# Altium schematic sheet ESP32_PCB.SchDoc
size A4; SheetNumber: 1; SheetTotal: 1
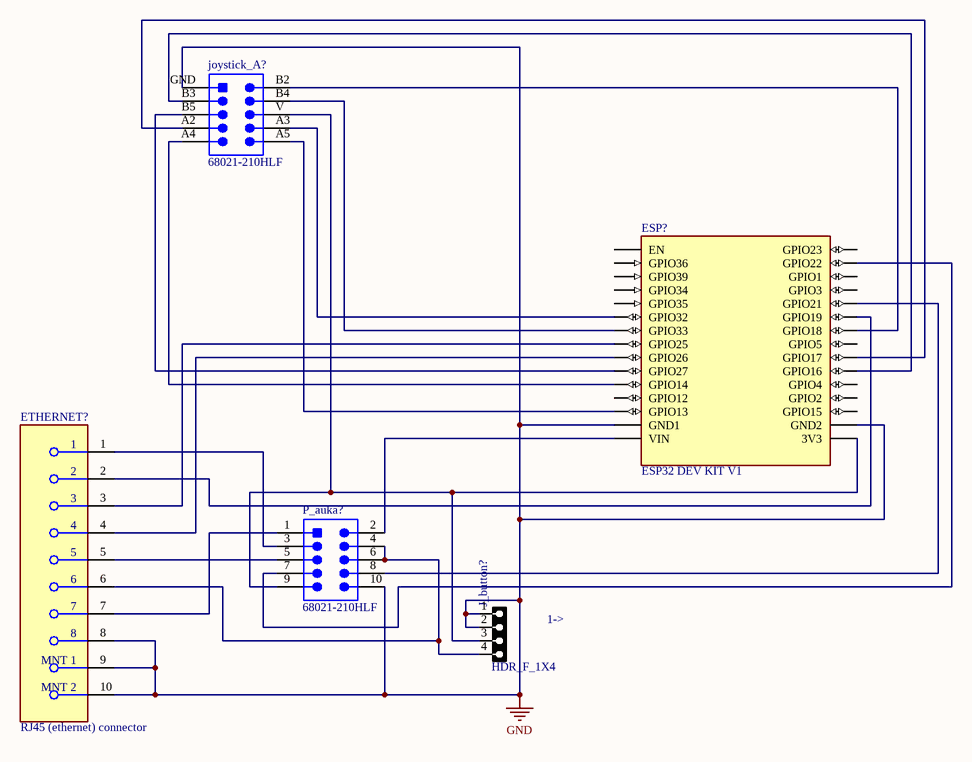
[diagram p0: ESP32_PCB.SchDoc]

## Parts
ESP?  ESP32 DEV KIT V1  [ESP32-DEV-KIT-V1]
ETHERNET?  RJ45 (ethernet) connector  [FP-1-406541-1-MFG]
J_button?  HDR_F_1X4  [HDR_F_1X4]
joystick_A?  68021-210HLF  [FCI-68021-210HLF-10_V]
P_auka?  68021-210HLF  [FCI-68021-210HLF-10_V]

## Nets
GND: ESP?.J1_14(GND1) ESP?.J3_14(GND2) ETHERNET?.8 ETHERNET?.9(MNT_1) ETHERNET?.10(MNT_2) J_button?.1 J_button?.2 joystick_A?.GND P_auka?.10
NetESP?_J1_6: ESP?.J1_6(GPIO32) joystick_A?.A3
NetESP?_J1_7: ESP?.J1_7(GPIO33) joystick_A?.B4
NetESP?_J1_8: ESP?.J1_8(GPIO25) ETHERNET?.3
NetESP?_J1_9: ESP?.J1_9(GPIO26) ETHERNET?.4
NetESP?_J1_10: ESP?.J1_10(GPIO27) joystick_A?.B5
NetESP?_J1_11: ESP?.J1_11(GPIO14) joystick_A?.A4
NetESP?_J1_13: ESP?.J1_13(GPIO13) joystick_A?.A5
NetESP?_J1_15: ESP?.J1_15(VIN) P_auka?.2
NetESP?_J3_2: ESP?.J3_2(GPIO22) P_auka?.7
NetESP?_J3_5: ESP?.J3_5(GPIO21) P_auka?.8
NetESP?_J3_6: ESP?.J3_6(GPIO19) ETHERNET?.2
NetESP?_J3_7: ESP?.J3_7(GPIO18) joystick_A?.B2
NetESP?_J3_9: ESP?.J3_9(GPIO17) joystick_A?.A2
NetESP?_J3_10: ESP?.J3_10(GPIO16) joystick_A?.B3
NetESP?_J3_15: ESP?.J3_15(3V3) J_button?.3 joystick_A?.V P_auka?.9
NetETHERNET?_1: ETHERNET?.1 P_auka?.3
NetETHERNET?_5: ETHERNET?.5 P_auka?.5
NetETHERNET?_6: ETHERNET?.6 J_button?.4 P_auka?.4 P_auka?.6
NetETHERNET?_7: ETHERNET?.7 P_auka?.1

Not connected (* = marked no-connect by the designer): ESP? J1_1(EN) J1_2(GPIO36) J1_3(GPIO39) J1_4(GPIO34) J1_5(GPIO35) J1_12(GPIO12) J3_1(GPIO23) J3_3(GPIO1) J3_4(GPIO3) J3_8(GPIO5) J3_11(GPIO4) J3_12(GPIO2) J3_13(GPIO15)

## Notes on the sheet
- 1->

## Library data of the parts
ESP? = CMP-020-00026-4: ESP-WROOM-32 https://www.aliexpress.com/item/1005006771532302.html; MF: Espressif Systems; Value: *; Pin Count: 30; Design Item ID: ESP32 DEV KIT V1; Source: ESP32-S3-DEVKITC-1-N8R8.SchLib; SnapEDA_Link: https://www.snapeda.com/parts/ESP32-S3-DEVKITC-1-N8R8/Espressif+Systems/view-part/?ref=snap; Package: None; Check_prices: https://www.aliexpress.com/item/1005006771532302.html; MP: ESP-WROOM-32; Component Type: Standard
ETHERNET? = CMP-002-00604-1: Modular Connector, RJ45 Jack, 1 x 1 (Port), 8P8C, Cat5, Through Hole Mount; Gender: Female; Pins: 2; Max Operating Temperature: 85°C; Min Operating Temperature: -40°C; Mounting Technology: Panel
J_button? = CMP-002-00296-3: Female header 1x4 2.54mm pitch; Location: v207; VALUE: HDRF4; Kit: Rover2026; Component Type: Standard; Design Item ID: HDR_F_1X4; Source: Conn Header.SchLib; Pins: 4
joystick_A? P_auka? = CMP-002-00020-2: Male Header, Pitch 2.54 mm, 2 x 5 Position, Height 4.83 mm, Tail Length 3.05 mm, Bulk; Manufacturer: FCI Electronics; Datasheet URL: http://portal.fciconnect.com/Comergent//fci/drawing/68020.pdf; Case/Package: 68021-210HLF-10; Manufacturer URL: http://portal.fciconnect.com/; Connector Type: Header; Mounting Technology: TH; Datasheet Version: Rev. BM, 04/2015; Package Description: Male Header, Pitch 2.54 mm, 2 x 5 Position, Height 4.83 mm, Tail Length 3.05 mm; Gender: Male; RoHS Compliant: Unknown; Package Reference: 68021-210HLF-10